# EAGLE design arduino_drivershield (EAGLE 6.2)
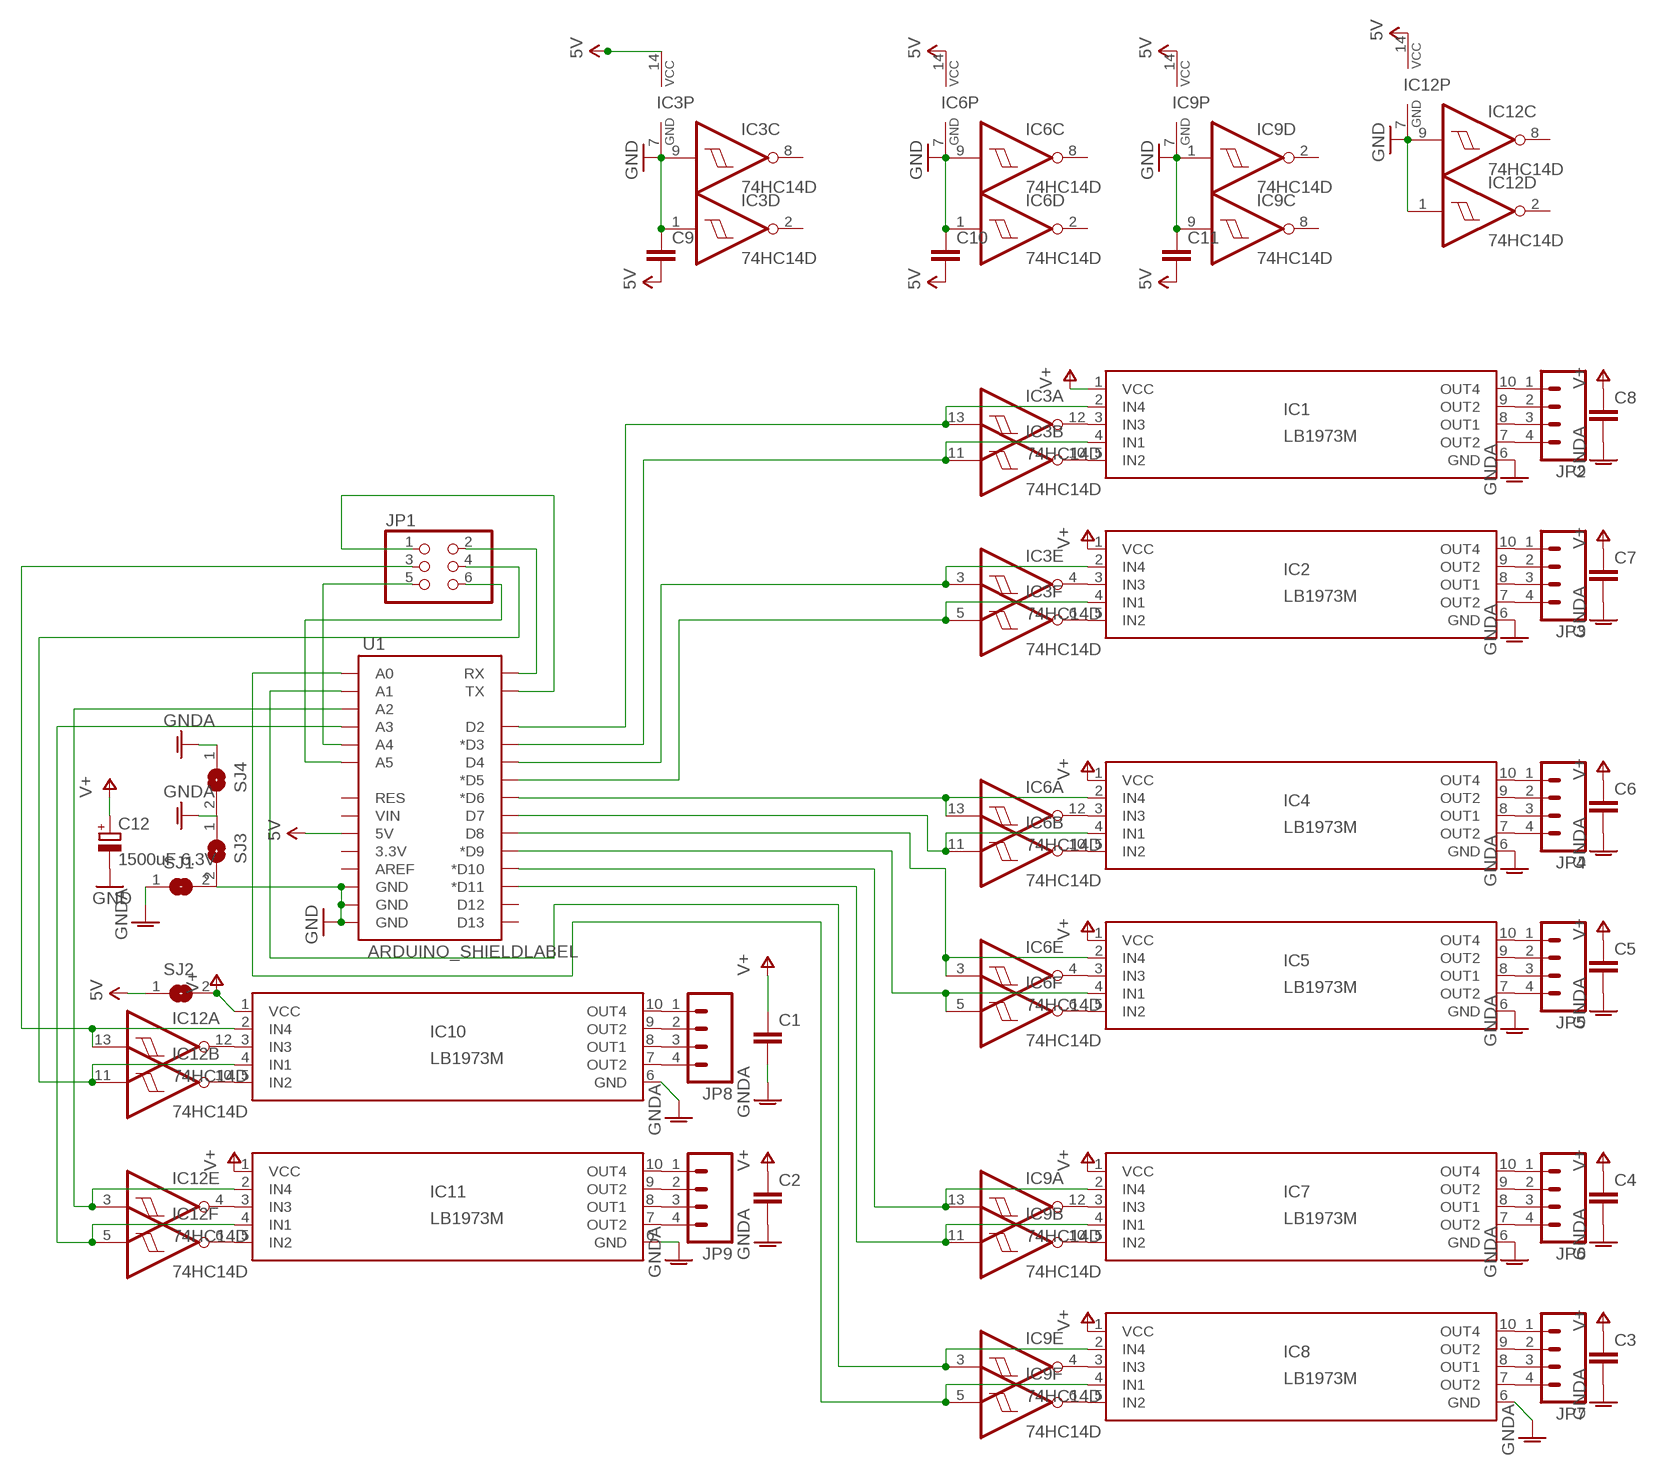
[diagram p0: schematic, sheet 1]

## Parts
C1  C-EUC0805  [C0805]
C2  C-EUC0805  [C0805]
C3  C-EUC0805  [C0805]
C4  C-EUC0805  [C0805]
C5  C-EUC0805  [C0805]
C6  C-EUC0805  [C0805]
C7  C-EUC0805  [C0805]
C8  C-EUC0805  [C0805]
C9  C-EUC0805  [C0805]
C10  C-EUC0805  [C0805]
C11  C-EUC0805  [C0805]
C12  1500uF 6.3V  CPOL-EUE5-10.5  [E5-10,5]
IC1  LB1973M  [SSOP10]
IC2  LB1973M  [SSOP10]
IC3  74HC14D  [SO14]
IC4  LB1973M  [SSOP10]
IC5  LB1973M  [SSOP10]
IC6  74HC14D  [SO14]
IC7  LB1973M  [SSOP10]
IC8  LB1973M  [SSOP10]
IC9  74HC14D  [SO14]
IC10  LB1973M  [SSOP10]
IC11  LB1973M  [SSOP10]
IC12  74HC14D  [SO14]
JP1  PINHD-2X3  [2X03]
JP2  M041X04_NO_SILK  [1X04_NO_SILK]
JP3  M041X04_NO_SILK  [1X04_NO_SILK]
JP4  M041X04_NO_SILK  [1X04_NO_SILK]
JP5  M041X04_NO_SILK  [1X04_NO_SILK]
JP6  M041X04_NO_SILK  [1X04_NO_SILK]
JP7  M041X04_NO_SILK  [1X04_NO_SILK]
JP8  M041X04_NO_SILK  [1X04_NO_SILK]
JP9  M041X04_NO_SILK  [1X04_NO_SILK]
SJ1  SJ  [SJ]
SJ2  SJ  [SJ]
SJ3  SJ  [SJ]
SJ4  SJ  [SJ]
U1  ARDUINO_SHIELDLABEL  [DUEMILANOVE_SHIELD]

## Nets
5V: C9.2 C10.2 C11.2 IC3.14(P:VCC) IC6.14(P:VCC) IC9.14(P:VCC) IC12.14(P:VCC) SJ2.1 U1.5V
GND: C9.1 C10.1 C11.1 C12.- IC3.1(D:I) IC3.7(P:GND) IC3.9(C:I) IC6.1(D:I) IC6.7(P:GND) IC6.9(C:I) IC9.1(D:I) IC9.7(P:GND) IC9.9(C:I) IC12.1(D:I) IC12.7(P:GND) IC12.9(C:I) SJ1.2 U1.GND@0(GND) U1.GND@1(GND) U1.GND@2(GND)
GND@PWR [power]: C1.2 C2.2 C3.2 C4.2 C5.2 C6.2 C7.2 C8.2 IC1.6(GND) IC2.6(GND) IC4.6(GND) IC5.6(GND) IC7.6(GND) IC8.6(GND) IC10.6(GND) IC11.6(GND) SJ1.1 SJ3.1 SJ4.1 ; supply symbol labelled GNDA
N$1: IC1.7(OUT2) JP2.4
N$2: IC1.8(OUT1) JP2.3
N$3: IC1.9(OUT2) JP2.2
N$4: IC1.10(OUT4) JP2.1
N$5: IC2.7(OUT2) JP3.4
N$6: IC2.8(OUT1) JP3.3
N$7: IC2.9(OUT2) JP3.2
N$8: IC2.10(OUT4) JP3.1
N$9: IC1.3(IN3) IC3.12(A:O)
N$10: IC1.5(IN2) IC3.10(B:O)
N$11: IC2.3(IN3) IC3.4(E:O)
N$12: IC2.5(IN2) IC3.6(F:O)
N$13: IC1.4(IN1) IC3.11(B:I) U1.D3(*D3)
N$14: IC1.2(IN4) IC3.13(A:I) U1.D2
N$15: IC2.2(IN4) IC3.3(E:I) U1.D4
N$16: IC2.4(IN1) IC3.5(F:I) U1.D5(*D5)
N$17: IC4.7(OUT2) JP4.4
N$18: IC4.8(OUT1) JP4.3
N$19: IC4.9(OUT2) JP4.2
N$20: IC4.10(OUT4) JP4.1
N$21: IC5.7(OUT2) JP5.4
N$22: IC5.8(OUT1) JP5.3
N$23: IC5.9(OUT2) JP5.2
N$24: IC5.10(OUT4) JP5.1
N$25: IC4.3(IN3) IC6.12(A:O)
N$26: IC4.5(IN2) IC6.10(B:O)
N$27: IC10.2(IN4) IC12.13(A:I) JP1.3
N$28: IC8.2(IN4) IC9.3(E:I) U1.A1
N$29: IC10.4(IN1) IC12.11(B:I) JP1.4
N$30: IC11.2(IN4) IC12.3(E:I) U1.A2
N$33: IC4.4(IN1) IC6.11(B:I) U1.D7
N$34: IC4.2(IN4) IC6.13(A:I) U1.D6(*D6)
N$35: IC5.2(IN4) IC6.3(E:I) U1.D8
N$36: IC5.4(IN1) IC6.5(F:I) U1.D9(*D9)
N$37: IC5.3(IN3) IC6.4(E:O)
N$38: IC5.5(IN2) IC6.6(F:O)
N$39: IC7.7(OUT2) JP6.4
N$40: IC7.8(OUT1) JP6.3
N$41: IC7.9(OUT2) JP6.2
N$42: IC7.10(OUT4) JP6.1
N$43: IC8.7(OUT2) JP7.4
N$44: IC8.8(OUT1) JP7.3
N$45: IC8.9(OUT2) JP7.2
N$46: IC8.10(OUT4) JP7.1
N$47: IC7.3(IN3) IC9.12(A:O)
N$48: IC7.5(IN2) IC9.10(B:O)
N$49: IC7.4(IN1) IC9.11(B:I) U1.D11(*D11)
N$50: IC7.2(IN4) IC9.13(A:I) U1.D10(*D10)
N$51: IC8.4(IN1) IC9.5(F:I) U1.A0
N$53: IC8.3(IN3) IC9.4(E:O)
N$54: IC8.5(IN2) IC9.6(F:O)
N$55: IC10.7(OUT2) JP8.4
N$56: IC10.8(OUT1) JP8.3
N$57: IC10.9(OUT2) JP8.2
N$58: IC10.10(OUT4) JP8.1
N$59: IC11.7(OUT2) JP9.4
N$60: IC11.8(OUT1) JP9.3
N$61: IC11.9(OUT2) JP9.2
N$62: IC11.10(OUT4) JP9.1
N$63: IC10.3(IN3) IC12.12(A:O)
N$64: IC10.5(IN2) IC12.10(B:O)
N$66: IC11.4(IN1) IC12.5(F:I) U1.A3
N$69: IC11.3(IN3) IC12.4(E:O)
N$70: IC11.5(IN2) IC12.6(F:O)
RX: JP1.2 U1.RX
SCL: JP1.6 U1.A5
SDA: JP1.5 U1.A4
TX: JP1.1 U1.TX
V+ [power]: C1.1 C2.1 C3.1 C4.1 C5.1 C6.1 C7.1 C8.1 C12.+ IC1.1(VCC) IC2.1(VCC) IC4.1(VCC) IC5.1(VCC) IC7.1(VCC) IC8.1(VCC) IC10.1(VCC) IC11.1(VCC) SJ2.2
Unconnected: IC3.2(D:O) IC3.8(C:O) IC6.2(D:O) IC6.8(C:O) IC9.2(D:O) IC9.8(C:O) IC12.2(D:O) IC12.8(C:O) SJ3.2 SJ4.2 U1.3.3V U1.AREF U1.D12 U1.D13 U1.RES U1.VIN

## Library data of the parts
C1-C11 = rcl:C-EU: CAPACITOR, European symbol
C12 = rcl:CPOL-EU: POLARIZED CAPACITOR, European symbol
IC1 IC2 IC4 IC5 IC7 IC8 IC10 IC11 = LB1973M:LB1973M: edit this description Auto generated by make-symbol-device-package-bsdl.ulp Rev. 43 Source:
IC3 IC6 IC9 IC12 = 74xx-eu:74*14: Hex schmitt trigger INVERTER
JP1 = SparkFun-Connectors:PINHD-2X3: PIN HEADER
JP2-JP9 = SparkFun-Connectors:M04: Header 4 Standard 4-pin 0.1" header. Use with straight break away headers (SKU : PRT-00116), right angle break away headers (PRT-00553), swiss pins (PRT-00743), machine pins (PRT-00117), and female headers (PRT-00115). Molex polarized connector foot print use with SKU : PRT-08231 with associated crimp pins and housings. 1MM SMD Version SKU: PRT-10208
SJ1-SJ4 = jumper:SJ: SMD solder JUMPER
U1 = SparkFun-Boards:ARDUINO_SHIELD: Arduino shield footprint

## Net classes
1 power: width 0.406 mm

## Board
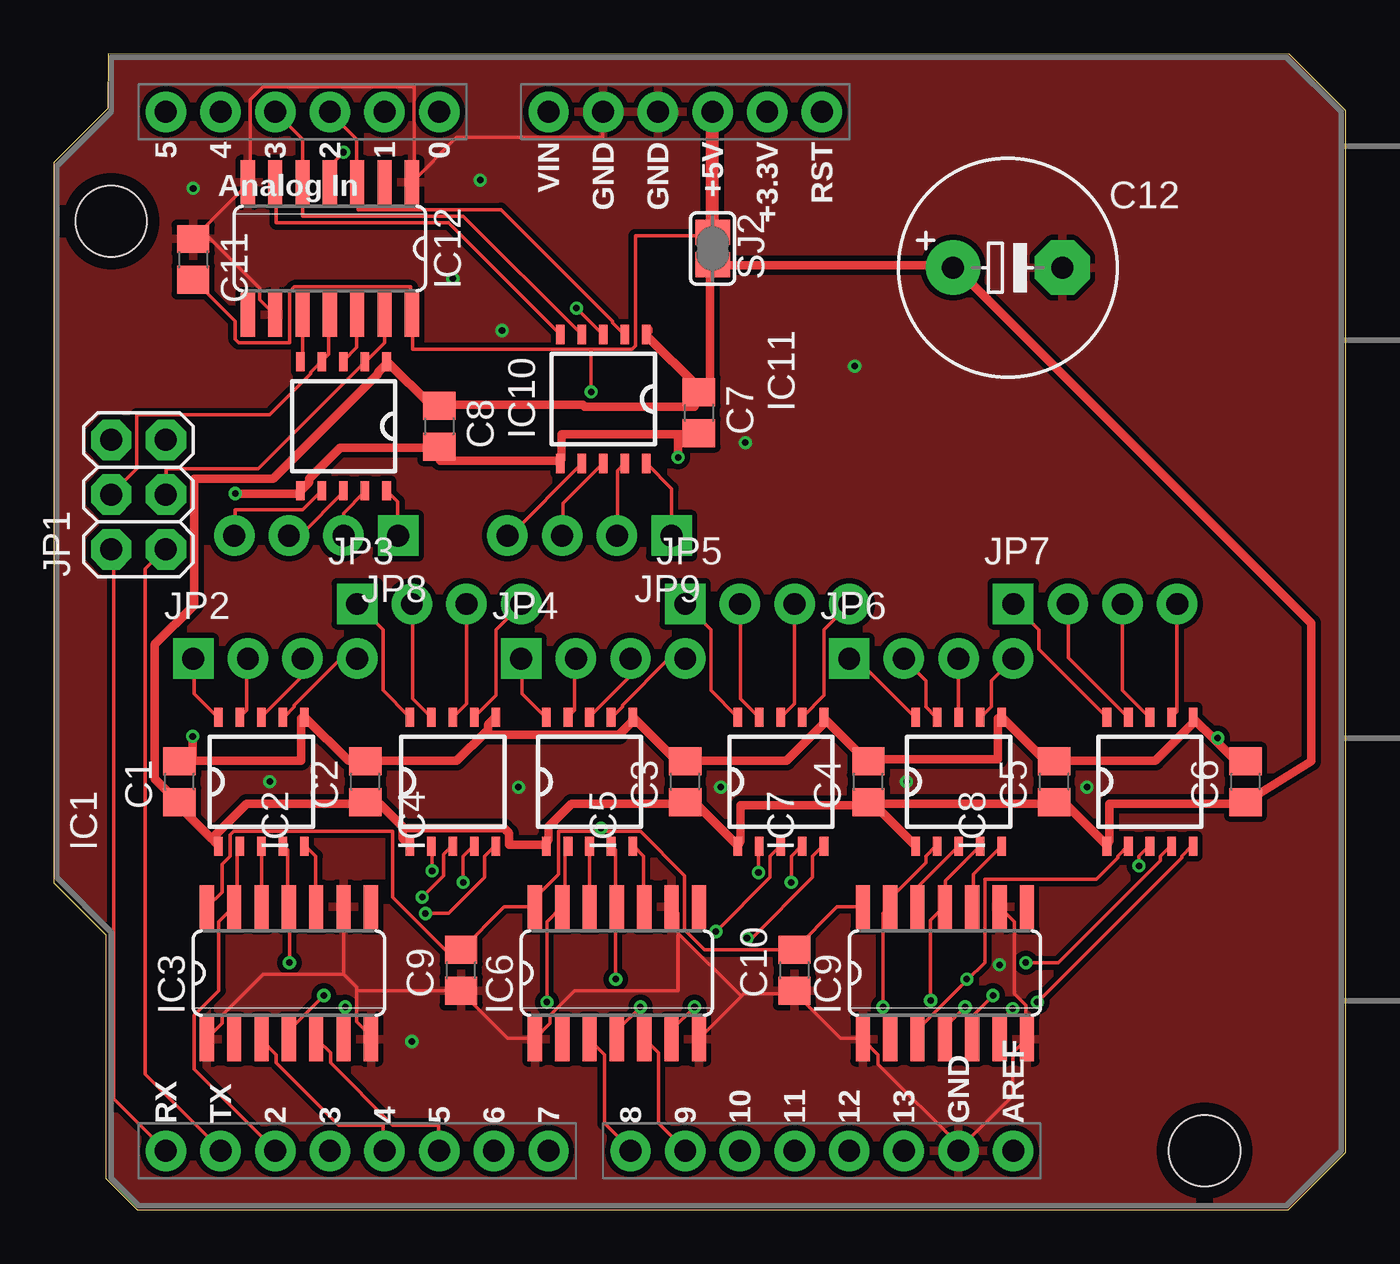
[diagram p1: board, top side]
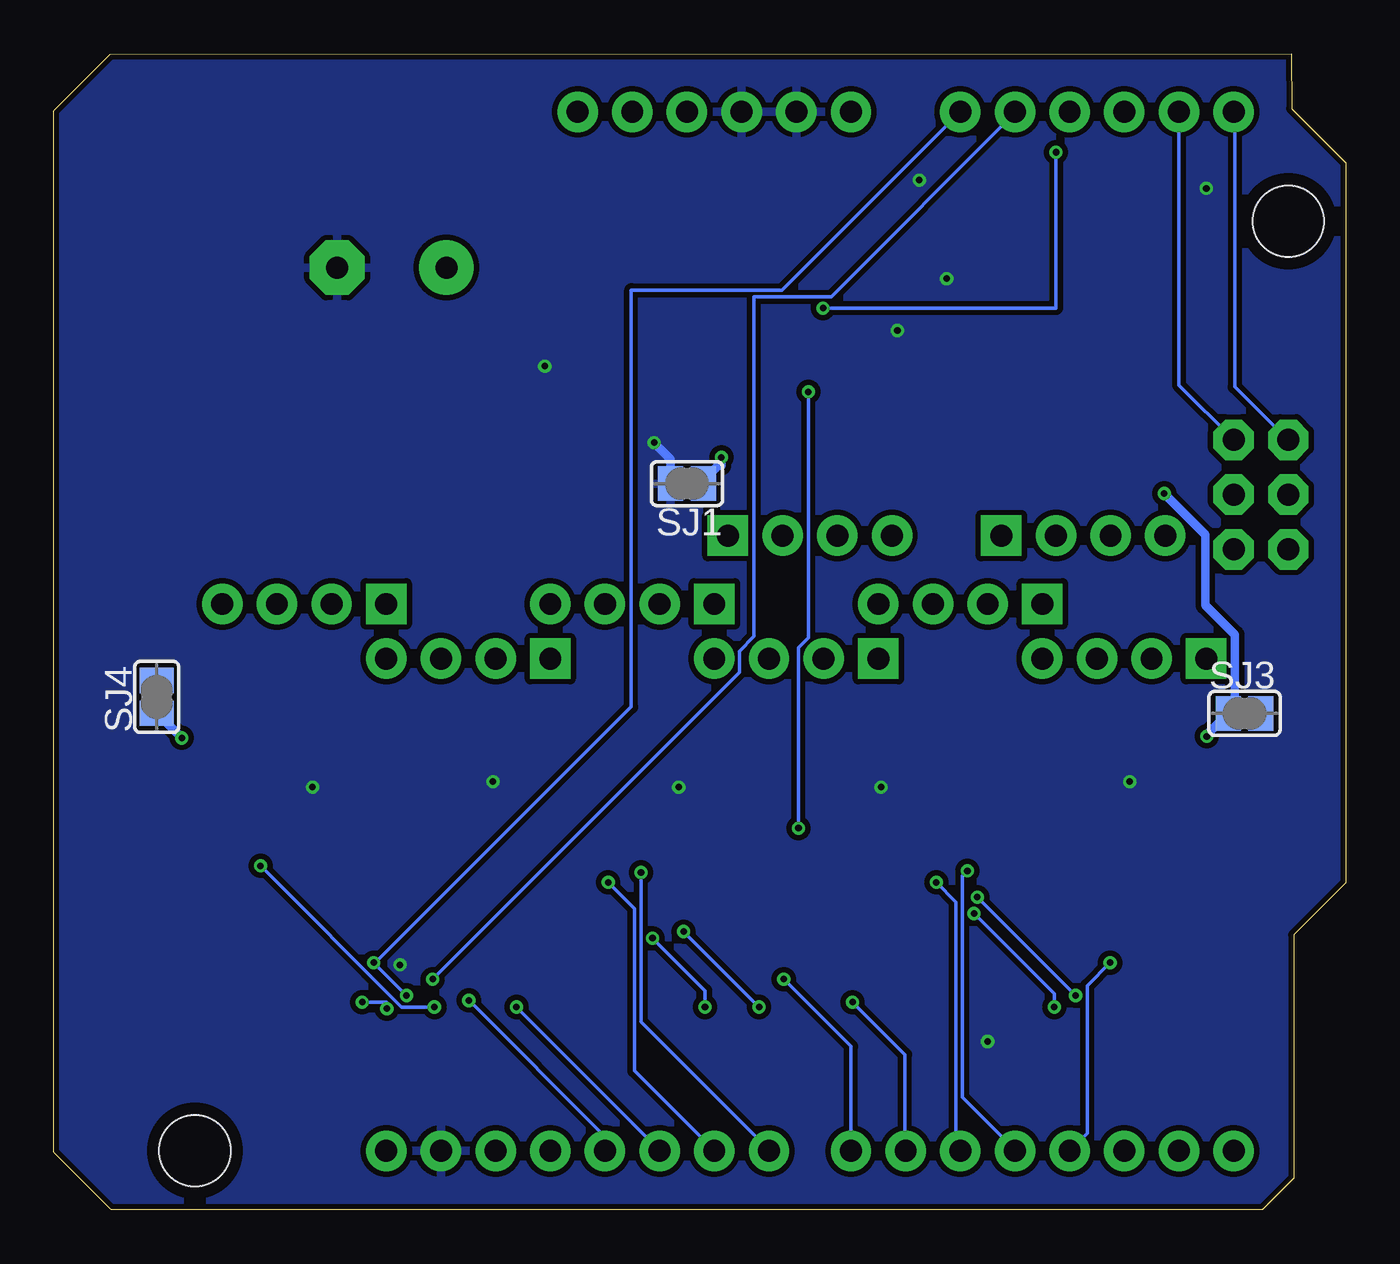
[diagram p2: board, bottom side, seen from below]

Size 60.03 x 53.7 mm. Coordinates in mm from the lower left corner, seen from the top.
Outline: 3.89,0 57.35,0 60.03,2.67 60.02,51.05 57.4,53.67 2.52,53.7 2.51,51.16 0,48.64 0,15.19 2.41,12.78 2.41,1.47 3.89,0
Copper layers (1*16): Top 0.035mm / dielectric 1.5mm / Bottom 0.035mm
Design rules: minimum track width 6mil, minimum drill 12mil, track to track 6mil, track to pad 6mil, pad to pad 6mil, via to via 6mil, smd to smd 0mil, copper to edge 10mil, drill to drill 10mil, minimum pad ring 10mil, minimum via ring 6mil, stop-mask expansion 2mil, vias tented up to drill 100mil, thermal gap 10mil

### Footprints (pad centres in the part's own frame; a part is rotated, then mirrored left to right if it is on the bottom)
C0805 = smd 1.3 x 1.5: 1 -0.95,0; 2 0.95,0
E5-10,5 = drill 1.016 pad 2.54: + -2.54,0 | drill 1.016 pad 2.54 octagon: - 2.54,0
SSOP10 = smd 0.9 x 0.4: 1 -2.996,2; 2 -2.996,1; 3 -2.996,0; 4 -2.996,-1; 5 -2.996,-2; 6 2.996,-2; 7 2.996,-1; 8 2.996,0; 9 2.996,1; 10 2.996,2
SO14 = smd 0.66 x 2.032: 1 -3.81,-3.073; 2 -2.54,-3.073; 3 -1.27,-3.073; 4 0,-3.073; 5 1.27,-3.073; 6 2.54,-3.073; 7 3.81,-3.073; 8 3.81,3.073; 9 2.54,3.073; 10 1.27,3.073; 11 0,3.073; 12 -1.27,3.073; 13 -2.54,3.073; 14 -3.81,3.073
2X03 = drill 1.016 pad 1.88 octagon: 1 -2.54,-1.27; 2 -2.54,1.27; 3 0,-1.27; 4 0,1.27; 5 2.54,-1.27; 6 2.54,1.27
1X04_NO_SILK = drill 1.016 pad 1.88 square: 1 0,0 | drill 1.016 pad 1.88: 2 2.54,0; 3 5.08,0; 4 7.62,0
SJ = smd 1.168 x 1.6: 1 -0.762,0; 2 0.762,0
DUEMILANOVE_SHIELD = drill 1.016 pad 1.88: 3.3V 50.8,26.67; 5V 50.8,29.21; A0 50.8,41.91; A1 50.8,44.45; A2 50.8,46.99; A3 50.8,49.53; A4 50.8,52.07; A5 50.8,54.61; AREF 2.54,15.24; D2 2.54,49.53; D3 2.54,46.99; D4 2.54,44.45; D5 2.54,41.91; D6 2.54,39.37; D7 2.54,36.83; D8 2.54,33.02; D9 2.54,30.48; D10 2.54,27.94; D11 2.54,25.4; D12 2.54,22.86; D13 2.54,20.32; GND@0 50.8,31.75; GND@1 50.8,34.29; GND@2 2.54,17.78; RES 50.8,24.13; RX 2.54,54.61; TX 2.54,52.07; VIN 50.8,36.83 | hole 3.302: 45.72,57.15; 2.54,6.35

### Placement (x,y rotation side)
C1  5.84,19.89 90 top
C2  14.48,19.89 90 top
C3  29.34,19.89 90 top
C4  37.85,19.89 90 top
C5  46.48,19.89 90 top
C6  55.37,19.89 90 top
C7  29.97,37.03 270 top
C8  17.91,36.4 270 top
C9  18.92,11.13 90 top
C10  34.42,11.13 90 top
C11  6.48,44.15 270 top
C12  44.32,43.76 0 top
IC1  9.65,19.89 90 top
IC2  18.54,19.89 90 top
IC3  10.92,11 0 top
IC4  24.89,19.89 90 top
IC5  33.78,19.89 90 top
IC6  26.16,11 0 top
IC7  42.04,19.89 90 top
IC8  50.93,19.89 90 top
IC9  41.4,11 0 top
IC10  13.46,36.4 270 top
IC11  25.53,37.67 270 top
IC12  12.83,44.65 180 top
JP1  3.94,33.22 90 top
JP2  6.48,25.6 0 top
JP3  14.1,28.14 0 top
JP4  21.72,25.6 0 top
JP5  29.34,28.14 0 top
JP6  36.96,25.6 0 top
JP7  44.58,28.14 0 top
JP8  16,31.32 180 top
JP9  28.7,31.32 180 top
SJ1  30.61,33.73 180 bottom
SJ2  30.61,44.65 270 top
SJ3  4.7,23.06 0 bottom
SJ4  55.25,23.83 90 bottom
U1  59.82,0.2 90 top

### Tracks (layer width: path | path; a pad name or v marks a point on that pad's centre or on a via)
5V  (via drill 0.3)
  Top 0.152: C11.2 6.53,43.18 8.43,41.28 8.43,40.44 8.59,40.28 10.95,40.28 10.95,42.65 11.18,42.88 16.59,42.88 16.59,41.58 IC12.14 16.66,41.58 16.66,39.98 24.97,39.98 | 24.97,39.98 26.87,39.98 27.03,40.13 27.03,45.24 30.38,45.24 SJ2.1 | 34.42,12.09 36.4,14.07 IC9.14 | IC3.14 7.14,14.07 7.82,14.76 7.82,16.05 8.2,16.43 8.2,17.42 8.36,17.58 15.75,17.58 15.75,14.53 18.19,12.09 18.87,12.09 C9.2 18.95,12.09 20.93,14.07 IC6.14 22.38,14.07 22.38,14.53 23.44,15.6 23.44,17.58 25.42,17.58 | 34.42,12.09 30.23,12.09 29.31,13.01 29.31,15.52 27.25,17.58 25.42,17.58 | 34.42,12.09 C10.2 | v24.97,38 24.97,39.98 | 25.42,17.58 v25.42,17.73
  Top 0.61: SJ2.1 U1.5V
  Bottom 0.152: v24.97,38 24.97,26.57 25.42,26.11 v25.42,17.73
GND  (via drill 0.3)
  Top 0.152: 14.76,7.98 IC3.7 14.76,8.05 14.07,8.74 14.07,10.19 | 13.46,10.95 9.73,10.95 7.82,9.04 7.82,8.66 7.14,7.98 IC3.1 | IC3.9 13.46,10.95 | 14.07,10.19 14.07,10.34 13.46,10.95 | 14.07,10.19 18.87,10.19 C9.1 18.95,10.11 21.08,7.98 22.3,7.98 IC6.1 22.38,7.98 23.06,8.66 23.06,9.04 24.21,10.19 29.01,10.19 29.01,12.78 29.04,12.81 | 31.94,9.92 32.05,10.03 34.42,10.03 C10.1 34.42,10.11 36.55,7.98 37.54,7.98 IC9.1 38.3,7.21 38.3,6.76 42.11,2.95 U1.GND@2 42.04,2.79 44.55,5.31 44.55,7.29 45.16,7.9 IC9.7 45.16,7.98 45.16,9.5 44.63,10.03 44.63,13.39 IC9.9 | 31.94,9.92 30,7.98 IC6.7 | IC6.9 29.01,13.77 29.01,12.85 29.04,12.81 | 31.94,9.92 29.04,12.81 | IC12.9 10.26,41.58 9.58,42.27 9.58,42.8 6.91,45.47 C11.1 6.53,45.16 8.97,47.6 8.97,47.68 IC12.7 9.12,47.83 9.12,51.56 9.73,52.17 16.74,52.17 16.74,47.9 IC12.1 18.72,49.81 25.5,49.81 25.5,50.95 U1.GND@1
  Top 0.406: v32.13,35.64 32.26,35.64
  Bottom 0.152: 25.65,50.95 U1.GND@1
  Bottom 0.406: v32.13,35.64 31.37,34.87 SJ1.2
  other vias: 20.83,40.84 18.54,43.26 19.81,47.83 43.94,11.38 16.64,7.82 6.48,47.45 21.59,19.63 30.99,19.63 39.62,19.89 48.01,19.63 10.03,19.89 37.21,39.19
  pour Bottom (isolate 0.254): 0.13,54.18 0.13,0.2 59.82,0.2 59.82,54.18
  pour Top (isolate 0.254): -0.13,54.31 -0.13,-0.3 60.07,-0.18 59.94,54.18
  pour Bottom (isolate 0.254): 3.17,52.4 3.43,1.22 48.77,1.35 48.64,51.77
GND@PWR  (via drill 0.3)
  Top 0.406: 53.96,21.81 54.91,20.85 55.37,20.85 C6.2 | 53.96,21.81 52.93,22.83 IC8.6 52.93,22.61 51.18,20.85 46.69,20.85 C5.2 46.46,20.85 46.08,20.85 44.09,22.83 IC7.6 43.87,22.83 43.87,20.93 38,20.93 C4.2 37.85,20.78 35.79,22.83 IC5.6 35.79,22.61 34.04,20.85 29.54,20.85 C3.2 29.31,20.85 28.93,20.85 26.95,22.83 IC4.6 26.87,22.68 26.26,22.07 20.17,22.07 20.05,22.19 | v54.08,21.92 53.96,21.81 | 23.52,34.72 IC11.6 | IC11.6 23.37,34.8 17.96,34.8 17.96,35.26 C8.2 17.88,35.41 13.31,35.41 11.86,33.96 11.86,33.81 11.48,33.43 IC10.6 11.33,33.27 v8.43,33.27 | 29.01,36.02 23.6,36.02 23.6,34.87 IC11.6 | 29.01,36.02 29.92,36.02 C7.2 | 29.01,36.02 v29.01,34.95 | 20.05,22.19 18.72,20.85 14.68,20.85 C2.2 14.45,20.85 13.69,20.85 11.71,22.83 IC1.6 11.48,22.83 11.48,20.85 5.84,20.85 C1.2 6.45,21.01 v6.45,22 | 20.05,22.19 20.17,22.3 20.17,22.53 20.47,22.83 IC2.6
  Bottom 0.406: v54.08,21.92 55.22,23.06 SJ4.1 | v29.01,34.95 29.01,34.57 29.16,34.57 29.46,34.26 29.46,34.11 SJ1.1 | v6.45,22 6.45,22.07 SJ3.1 5.38,23.22 5.16,23.44 5.16,26.72 6.53,28.09 6.53,31.37 v8.43,33.27
N$1
  Top 0.152: IC1.7 10.72,22.91 11.18,23.37 11.18,23.44 13.31,25.58 14.07,25.58 JP2.4
N$2
  Top 0.152: JP2.3 11.56,24.82 9.65,22.91 IC1.8
N$3
  Top 0.152: IC1.9 8.66,22.91 8.97,23.22 8.97,25.58 JP2.2
N$4
  Top 0.152: IC1.10 7.59,22.91 6.53,23.98 6.53,25.58 JP2.1
N$5
  Top 0.152: IC2.7 19.56,22.91 20.55,23.9 20.55,26.95 21.69,28.09 JP3.4
N$6
  Top 0.152: JP3.3 19.18,23.52 18.57,22.91 IC2.8
N$7
  Top 0.152: IC2.9 17.5,22.91 16.66,23.75 16.66,28.09 JP3.2
N$8
  Top 0.152: JP3.1 15.29,26.95 15.29,24.13 16.51,22.91 IC2.10
N$9
  Top 0.152: IC3.12 IC1.3
N$10
  Top 0.152: IC1.5 11.71,16.89 12.17,16.43 12.17,14.07 IC3.10
N$11  (via drill 0.3)
  Top 0.152: v17.12,14.53 18.11,15.52 18.11,16.51 18.49,16.89 IC2.3 | v12.55,9.96 10.95,8.36 10.95,7.98 IC3.4
  Bottom 0.152: v12.55,9.96 v17.12,14.53
N$12  (via drill 0.3)
  Top 0.152: v17.27,13.77 18.34,13.77 20.02,15.44 20.02,16.43 20.47,16.89 IC2.5 | v13.54,9.42 13.46,9.35 IC3.6
  Bottom 0.152: v17.27,13.77 13.54,10.03 v13.54,9.42
N$13  (via drill 0.3)
  Top 0.152: IC1.4 10.72,16.89 10.87,16.74 10.87,14.07 IC3.11 10.95,14.07 v10.95,11.48
  Bottom 0.152: v10.95,11.48 12.01,10.41 12.01,3.56 U1.D3
N$14
  Top 0.152: IC1.2 8.59,16.89 8.51,16.82 8.51,14.15 8.43,14.07 IC3.13 8.36,14.07 7.67,13.39 7.67,10.19 6.53,9.04 6.53,6.53 10.26,2.79 U1.D2
N$15  (via drill 0.3)
  Top 0.152: v17.58,15.75 17.58,16.89 IC2.2 | IC3.3 9.65,7.9 10.34,7.21 10.34,6.83 13.23,3.94 15.29,3.94 15.29,2.87 15.37,2.79 U1.D4
  Bottom 0.152: v17.58,15.75 17.8,15.52 17.8,5.23 15.37,2.79 U1.D4
N$16  (via drill 0.3)
  Top 0.152: v19.02,15.21 19.02,16.43 19.48,16.89 IC2.4 | IC3.5 12.24,7.9 12.85,7.29 12.85,6.83 15.75,3.94 17.88,3.94 17.88,2.79 U1.D5
  Bottom 0.152: v19.02,15.21 18.11,14.3 18.11,2.95 U1.D5
N$17
  Top 0.152: IC4.7 25.96,22.91 26.42,23.37 26.42,23.44 28.55,25.58 29.31,25.58 JP4.4
N$18
  Top 0.152: JP4.3 26.8,24.82 24.89,22.91 IC4.8
N$19
  Top 0.152: IC4.9 23.9,22.91 24.21,23.22 24.21,25.58 JP4.2
N$20
  Top 0.152: IC4.10 22.83,22.91 21.77,23.98 21.77,25.58 JP4.1
N$21
  Top 0.152: IC5.7 34.8,22.91 35.79,23.9 35.79,26.95 36.93,28.09 JP5.4
N$22
  Top 0.152: JP5.3 34.42,23.52 33.81,22.91 IC5.8
N$23
  Top 0.152: IC5.9 32.74,22.91 31.9,23.75 31.9,28.09 JP5.2
N$24
  Top 0.152: JP5.1 30.53,26.95 30.53,24.13 31.75,22.91 IC5.10
N$25
  Top 0.152: IC6.12 IC4.3
N$26
  Top 0.152: IC4.5 26.95,16.89 27.41,16.43 27.41,14.07 IC6.10
N$27
  Top 0.152: IC12.13 15.37,40.28 14.53,39.45 IC10.2 14.45,39.37 9.5,34.42 5.23,34.42 5.23,33.27 JP1.3
N$28  (via drill 0.3)
  Top 0.152: 42.46,10.68 40.13,8.36 IC9.3 | 42.46,10.68 43.26,11.48 43.26,15.37 48.44,15.37 49.43,16.36 49.43,16.43 49.89,16.89 IC8.2 | v42.42,10.72 42.46,10.68
  Bottom 0.152: v42.42,10.72 28.17,24.97 28.17,25.96 27.48,26.64 27.48,42.42 23.9,42.42 15.37,50.95 U1.A1
N$29
  Top 0.152: IC12.11 12.78,41.58 12.78,39.75 12.47,39.45 IC10.4 12.4,39.37 11.94,38.91 11.94,38.84 10.03,36.93 3.86,36.93 3.86,34.42 JP1.4
N$30
  Top 0.152: IC11.2 26.49,40.67 25.96,41.2 25.96,41.28 20.78,46.46 14.15,46.46 14.15,47.68 IC12.3 14.07,47.75 14.07,49.73 12.85,50.95 U1.A2
N$33  (via drill 0.3)
  Top 0.152: 26.11,14.07 26.11,16.74 25.96,16.89 IC4.4 | v26.11,10.72 26.11,14.07 | 26.11,14.07 IC6.11
  Bottom 0.152: v26.11,10.72 22.99,7.59 U1.D7
N$34  (via drill 0.3)
  Top 0.152: IC4.2 23.82,16.89 23.75,16.82 23.75,14.15 23.67,14.07 IC6.13 23.6,14.07 22.91,13.39 v22.91,9.65
  Bottom 0.152: v22.91,9.65 20.47,7.21 20.47,2.79 U1.D6
N$35  (via drill 0.3)
  Top 0.152: v32.74,15.67 32.74,16.89 IC5.2 | IC6.3 24.89,7.9 25.58,7.21 25.58,4.01 26.8,2.79 U1.D8
  Bottom 0.152: v32.74,15.67 32.74,8.74 26.8,2.79 U1.D8
N$36  (via drill 0.3)
  Top 0.152: v34.27,15.21 34.27,16.43 34.72,16.89 IC5.4 | IC6.5 27.48,7.9 28.09,7.29 28.09,4.01 29.31,2.79 U1.D9
  Bottom 0.152: v34.27,15.21 33.05,14 33.05,6.45 U1.D9
N$37  (via drill 0.3)
  Top 0.152: v30.76,12.93 33.27,15.44 33.27,16.43 33.73,16.89 IC5.3 | v27.25,9.42 26.19,8.36 26.19,7.98 IC6.4
  Bottom 0.152: v27.25,9.42 v30.76,12.93
N$38  (via drill 0.3)
  Top 0.152: v32.21,12.62 32.44,12.62 35.26,15.44 35.26,16.43 35.71,16.89 IC5.5 | v29.77,9.42 28.7,8.36 IC6.6
  Bottom 0.152: v32.21,12.62 29.77,10.19 v29.77,9.42
N$39
  Top 0.152: JP6.4 43.56,24.59 43.56,23.37 43.1,22.91 IC7.7
N$40
  Top 0.152: JP6.3 IC7.8
N$41
  Top 0.152: JP6.2 40.51,24.59 40.51,23.37 40.97,22.91 IC7.9
N$42
  Top 0.152: IC7.10 39.98,22.91 37.31,25.58 37.01,25.58 JP6.1
N$43
  Top 0.152: IC8.7 51.94,22.91 52.17,23.14 52.17,28.09 JP7.4
N$44
  Top 0.152: JP7.3 49.66,24.13 50.88,22.91 IC8.8
N$45
  Top 0.152: IC8.9 49.89,22.91 47.14,25.65 47.14,28.09 JP7.2
N$46
  Top 0.152: JP7.1 45.77,26.95 45.77,26.04 48.9,22.91 IC8.10
N$47
  Top 0.152: IC9.12 40.13,14.99 IC7.3
N$48
  Top 0.152: IC7.5 44.02,16.89 42.72,15.6 42.72,14.07 IC9.10
N$49  (via drill 0.3)
  Top 0.152: IC7.4 41.43,15.29 41.43,14.07 IC9.11 41.35,14.07 40.74,13.46 v40.74,9.73
  Bottom 0.152: v40.74,9.73 34.42,3.4 U1.D11
N$50  (via drill 0.3)
  Top 0.152: IC7.2 40.97,16.89 40.51,16.43 40.51,16.13 38.91,14.53 38.91,14.07 IC9.13 38.84,14.07 38.53,13.77 v38.53,9.42
  Bottom 0.152: v38.53,9.42 31.9,2.79 U1.D10
N$51  (via drill 0.3)
  Top 0.152: v45.16,11.48 46.69,11.48 51.41,16.21 51.41,16.43 51.87,16.89 IC8.4 | v43.64,9.96 42.72,9.04 42.72,7.98 IC9.5
  Bottom 0.152: v43.64,9.96 v45.16,11.48 45.09,11.48 33.2,23.37 33.2,42.72 26.19,42.72 U1.A0
N$53  (via drill 0.3)
  Top 0.152: v50.42,15.98 50.42,16.43 50.88,16.89 IC8.3 | v42.34,9.42 41.43,8.51 41.43,7.98 IC9.4
  Bottom 0.152: v50.42,15.98 43.87,9.42 v42.34,9.42
N$54  (via drill 0.3)
  Top 0.152: v45.7,9.65 52.4,16.36 52.4,16.43 52.86,16.89 IC8.5 | v44.55,9.35 43.94,8.74 IC9.6
  Bottom 0.152: v45.7,9.65 44.55,9.65 v44.55,9.35
N$55
  Top 0.152: IC10.7 12.4,33.35 11.56,32.51 8.43,32.51 8.43,31.37 JP8.4
N$56
  Top 0.152: IC10.8 13.46,33.35 11.48,31.37 10.95,31.37 JP8.3
N$57
  Top 0.152: JP8.2 13.46,32.36 14.45,33.35 IC10.9
N$58
  Top 0.152: IC10.10 15.52,33.35 15.98,32.89 15.98,31.37 JP8.1
N$59
  Top 0.152: IC11.7 24.51,34.65 21.23,31.37 21.08,31.37 JP9.4
N$60
  Top 0.152: IC11.8 25.5,34.65 23.67,32.82 23.67,31.37 JP9.3
N$61
  Top 0.152: IC11.9 26.49,34.65 26.19,34.34 26.19,31.37 JP9.2
N$62
  Top 0.152: JP9.1 28.7,33.5 27.56,34.65 IC11.10
N$63
  Top 0.152: IC10.3 13.46,39.45 14.07,40.06 14.07,41.58 IC12.12
N$64
  Top 0.152: IC12.10 11.56,39.52 11.48,39.45 IC10.5
N$66
  Top 0.152: IC11.4 24.51,40.67 19.02,46.15 11.56,46.15 IC12.5 11.56,49.73 U1.A3
N$69  (via drill 0.3)
  Top 0.152: v24.28,41.88 25.5,40.67 IC11.3 | v13.46,49.12 12.85,48.51 12.85,47.75 IC12.4
  Bottom 0.152: v24.28,41.88 13.46,41.88 v13.46,49.12
N$70
  Top 0.152: IC11.5 18.34,45.85 10.34,45.85 10.34,47.68 IC12.6
RX
  Top 0.152: U1.RX 2.79,5.16 2.79,30.61 2.72,30.68 JP1.2
SCL
  Bottom 0.152: JP1.6 2.72,35.79 5.16,38.23 5.16,50.95 U1.A5
SDA
  Bottom 0.152: JP1.5 7.75,38.3 U1.A4
TX
  Top 0.152: U1.TX 7.75,2.79 4.24,6.3 4.24,29.77 5.16,30.68 JP1.1
V+
  Top 0.406: 27.63,40.89 27.63,40.82 IC11.1 27.56,40.59 29.92,38.23 29.92,38 C7.1 29.77,37.92 29.77,37.31 24.66,37.31 24.59,37.39 18.11,37.39 C8.1 17.88,37.39 17.5,37.39 15.52,39.37 IC10.1 15.37,39.22 15.06,38.91 15.06,38.84 10.19,33.96 6.53,33.96 6.53,28.09 4.7,26.26 4.7,20.02 5.69,19.02 C1.1 5.84,18.72 7.33,17.23 | 7.33,17.23 7.59,16.97 IC1.1 | 16.2,17.73 16.2,17.81 15.14,18.87 14.53,18.87 C2.1 14.3,18.87 8.97,18.87 7.33,17.23 | 16.2,17.73 16.2,17.27 16.51,16.97 IC2.1 | 16.2,17.73 20.93,17.73 21.16,17.5 21.16,16.97 22.83,16.97 IC4.1 22.91,17.12 22.99,17.2 22.99,17.81 24.05,18.87 29.16,18.87 C3.1 29.39,18.87 29.84,18.87 31.75,16.97 IC5.1 31.9,17.12 31.9,18.8 37.69,18.8 C4.1 | IC7.1 39.98,16.97 38.08,18.87 37.85,18.87 C4.1 | C4.1 38.3,18.87 46.3,18.87 C5.1 46.53,18.87 46.99,18.87 48.9,16.97 IC8.1 49.05,17.12 49.05,18.87 55.37,18.87 C6.1 58.42,20.84 58.42,27.25 41.91,43.76 | 41.91,43.76 41.81,43.87 30.61,43.87 SJ2.2 30.53,43.71 30.48,43.71 | 30.48,43.76 30.48,43.71 | 30.48,43.71 30.48,37.92 | C12.+ 41.91,43.76